# Altium schematic sheet 7_电子天平_Buzzer.SchDoc: 电子天平_Buzzer
size A4; Date: 2020/01/07; ApprovedBy: Riggin; CheckedBy: Riggin; Author: Riggin; DrawnBy: Riggin; Engineer: Riggin; DocumentNumber: 8; Revision: V1.0; SheetNumber: 8; SheetTotal: 8; Time: 14:09:34; ProjectName: 电子天平
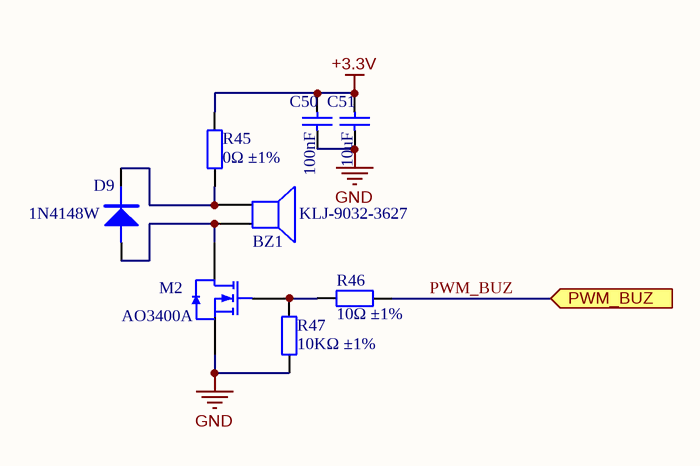
[diagram p0: 7_电子天平_Buzzer.SchDoc]

## Parts
BZ1  KLJ-9032-3627  [BUZZER_SMD1]
C50  100nF  [LC-0805_C]
C51  10uF  [LC-1206_C]
D9  1N4148W  [LC-SOD-123]
M2  AO3400A  [LC-SOT-23(SOT-23-3)]
R45  0Ω ±1%  [LC-0805_R]
R46  10Ω ±1%  [LC-0805_R]
R47  10KΩ ±1%  [LC-0805_R]

## Ports
PWM_BUZ (in)

## Nets
+3.3V: C50.1 C51.1 R45.2
GND: C50.2 C51.2 M2.2(S) R47.2
PWM_BUZ: R46.2 ; port PWM_BUZ
NetBZ1_1: BZ1.1 D9.K R45.1
NetBZ1_2: BZ1.2 D9.A M2.3(D)
NetM2_1: M2.1(G) R46.1 R47.1

## Notes on the sheet
- Title
- Company:
- Address:
- 广东省广州市
- DZT Studio
- Size:
- Date:
- Drawn By:
- A4
- Riggin
- Time:
- Revision:
- Approved By:
- Sheet
- of
- Email:
- RigginLi@icloud.com
- Project:

## Library data of the parts
BZ1 = Speaker: 额定电压3.6V  谐振频率2731Hz  线圈电阻16Ω; Published: 24-Mar-1999; LatestRevisionDate: 17-Jul-2002; LatestRevisionNote: Re-released for DXP Platform.; PackageReference: PIN2; Publisher: Altium Limited
C50 C51 = Cap: MLCC; Value: 100pF; Published: 8-Jun-2000; LatestRevisionDate: 17-Jul-2002; LatestRevisionNote: Re-released for DXP Platform.; PackageReference: RAD-0.3; Publisher: Altium Limited; PackageDescription: Radial Cap, Thru-Hole; 2 Leads; 0.3 in Pin Spacing
D9 = DIODE: 100V，150mA，VF=1.25V@150mA
M2 = AO3400A N道沟 X0YV1T SOT-23: MOS(场效应管); ComponentLink1Description: 供应商链接; ComponentLink1URL: http://www.szlcsc.com/product/details_21629.html; Package: SOT-23; Supplier: LC; SuppliersPartNumber: C20917
R45-R47 = Res2: Resistor; Value: 1K; Published: 8-Jun-2000; LatestRevisionDate: 17-Jul-2002; LatestRevisionNote: Re-released for DXP Platform.; PackageReference: AXIAL-0.4; Publisher: Altium Limited; PackageDescription: Axial Device, Thru-Hole; 2 Leads; 0.4 in Pin Spacing